# Altium project golden_arduino.PrjPcb
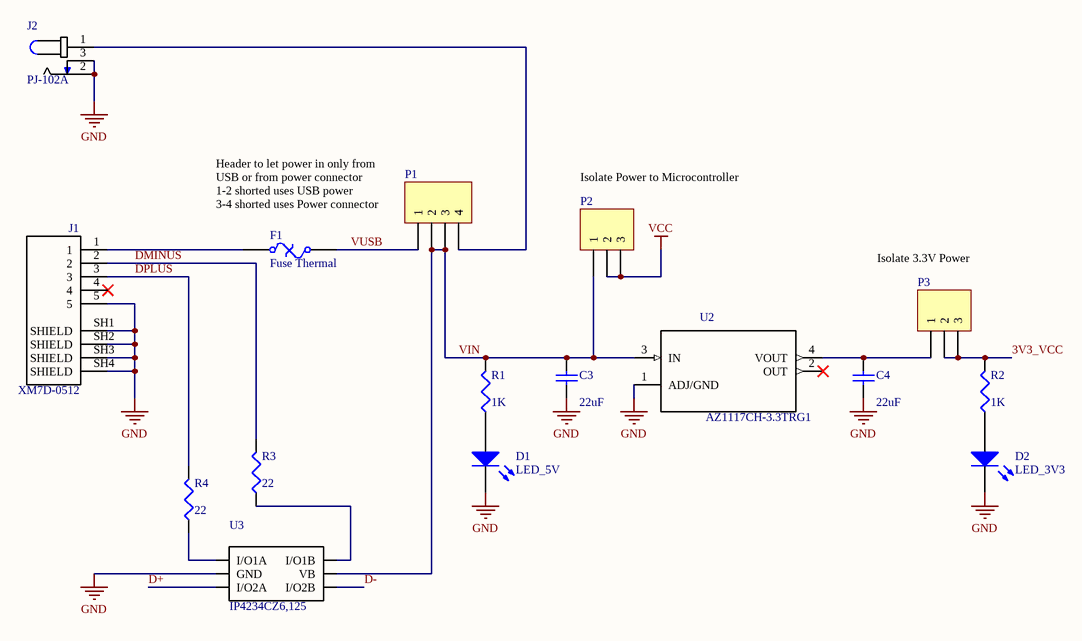
[diagram p0: power.SchDoc]
3 sheets, 59 parts. Net scope: global (net labels, ports and power ports of the same name join across sheets).
Board file: golden_arduino.PcbDoc
Sheets:
  power.SchDoc
  micro.SchDoc
  peripherals.SchDoc

## Sheet power.SchDoc: Arduino_Power
size A4; DocumentNumber: 1; SheetNumber: 1; SheetTotal: 3

### Parts
C3  value 22uF  [C1206]  (hidden comment: Cap Semi)
C4  value 22uF  [C1206]  (hidden comment: Cap Semi)
D1  LED_5V  [3.2X1.6X1.1]
D2  LED_3V3  [3.2X1.6X1.1]
F1  Fuse Thermal  [1812]
J1  XM7D-0512  [*OMRON_XM7D-0512_XM7D-0512(Primary)]
J2  PJ-102A  [*CUI_PJ-102A]
P1  Header 4  [HDR1X4]  (value not drawn)
P2  ON   OFF  [HDR1X3]  (value not drawn)
P3  3.3 NC  [HDR1X3]  (value not drawn)
R1  value 1K  [C1206]  (hidden comment: Res3)
R2  value 1K  [C1206]  (hidden comment: Res3)
R3  value 22  [C1206]  (hidden comment: Res3)
R4  value 22  [C1206]  (hidden comment: Res3)
U2  AZ1117CH-3.3TRG1  [*SOT230P696X180-4N]
U3  IP4234CZ6,125  [*SOT-457]

### Nets
GND: C3.1 C4.1 D1.2(K) D2.2(K) J1.5 J1.SH1(SHIELD) J1.SH2(SHIELD) J1.SH3(SHIELD) J1.SH4(SHIELD) J2.2 J2.3 U2.1(ADJ/GND) U3.2(GND)
VCC: P2.2 P2.3
3V3_VCC: P3.2 P3.3 R2.2
D+: U3.3(I/O2A)
D-: U3.4(I/O2B)
DMINUS: J1.2 R3.2
DPLUS: J1.3 R4.2
VIN: C3.2 P1.2 P1.3 P2.1 R1.2 U2.3(IN) U3.5(VB)
VUSB: F1.2 P1.1
NetC4_2: C4.2 P3.1 U2.4(VOUT)
NetD1_1: D1.1(A) R1.1
NetD2_1: D2.1(A) R2.1
NetF1_1: F1.1 J1.1
NetJ2_1: J2.1 P1.4
NetR3_1: R3.1 U3.6(I/O1B)
NetR4_1: R4.1 U3.1(I/O1A)

Not connected (* = marked no-connect by the designer): J1 4*; U2 2(OUT)*

### Notes on the sheet
- Isolate Power to Microcontroller
- Header to let power in only from
  USB or from power connector
  1-2 shorted uses USB power
  3-4 shorted uses Power connector
- Isolate 3.3V Power
- Title
- Size:
- Date:
- A4
- Number:
- Time:
- Revision:
- Sheet
- of
- File:

### Library data of the parts
C3 C4 = Cap Semi: Capacitor (Semiconductor SIM Model); Published: 8-Jun-2000; LatestRevisionDate: 29-May-2009; LatestRevisionNote: IPC-7351 Footprint Added.; PackageReference: C1206; Publisher: Altium Limited; PackageDescription: Chip Capacitor; DigiKeyPartNo: 1276-3300-1-ND
D1 D2 = LED2: Typical RED, GREEN, YELLOW, AMBER GaAs LED; Published: 8-Jun-2000; LatestRevisionDate: 17-Jul-2002; LatestRevisionNote: Re-released for DXP Platform.; PackageVersion: Feb-2002; PackageReference: 3.2X1.6X1.1; Publisher: Altium Limited; PackageDescription: SM LED; 2 Flat Leads
F1 = Fuse Thermal: Thermal Fuse; ManufacturerPartNo: MF-MSMF050-2; Published: 24-Mar-1999; LatestRevisionDate: 17-Jul-2002; LatestRevisionNote: Re-released for DXP Platform.; PackageReference: 1812; Publisher: Altium Limited; PackageDescription: Thru-Hole; 2 Leads; DigiKeyPartNo: MF-MSMF050-2CT-ND
J1 = XM7D-0512: Conn Mini USB Type B SKT 5 POS 0.8mm Solder RA Thru-Hole 5 Terminal 1 Port; MF: Omron Electronics; Availability: Unavailable; MP: XM7D-0512; SnapEDA_Link: https://www.snapeda.com/parts/XM7D-0512/Omron%20Electronics%20Inc-EMC%20Div/view-part/?ref=snap; Price: None; Package: None; Value: *; ComponentLink1URL: https://www.digikey.com/product-detail/en/omron-electronics-inc-emc-div/XM7D-0512/OR1205-ND/4695531
J2 = PJ-102A: 2.0 mm Center Pin, 2.5 A, Right Angle, Through Hole, Tapered Pins, Dc Power Jack Connector; MF: CUI Inc.; Price: None; CUI_purchase_URL: https://www.cui.com/product/interconnect/dc-power-connectors/jacks/2.0-mm-center-pin/pj-102a?utm_source=snapeda.com&utm_medium=referral&utm_campaign=snapedaBOM; Package: None; SnapEDA_Link: https://www.snapeda.com/parts/PJ-102A/CUI%20Inc./view-part/?ref=snap; Availability: Unavailable; MP: PJ-102A; Value: *
P1 = Header 4: Header, 4-Pin; LatestRevisionDate: 17-Jul-2002; LatestRevisionNote: Re-released for DXP Platform.; Publisher: Altium Limited
P2 P3 = Header 3: Header, 3-Pin; LatestRevisionDate: 17-Jul-2002; LatestRevisionNote: Re-released for DXP Platform.; Publisher: Altium Limited
R1-R4 = Res3: Resistor; Published: 8-Jun-2000; LatestRevisionDate: 29-May-2009; LatestRevisionNote: IPC-7351 Footprint Added.; PackageReference: J1-0603; Publisher: Altium Limited; PackageDescription: Chip Resistor
U2 = LM1117MP-3.3: Voltage stabiliser; LDO, fixed; 3.3V; 0.8A; SOT223; SMD; MF: Diodes Incorporated; Price: None; Package: SOT-223 Texas Instruments; SnapEDA_Link: https://www.snapeda.com/parts/LM1117MP-3.3/NOPB/Texas%20Instruments/view-part/?ref=snap; Availability: Unavailable; MP: AZ1117CH-3.3TRG1; Value: *; DigiKeyPartNo: AZ1117CH-3.3TRG1DICT-ND
U3 = IP4234CZ6: DIODE, ESD TVS, USB2.0, SOT457; Operating Voltage: 3V; No. of Pins: 6; SVHC: No SVHC _18-Jun-2010_; MF: NXP Semiconductors; Package: SO-6 NXP Semiconductors; MP: IP4234CZ6,125; Price: None; SnapEDA_Link: https://www.snapeda.com/parts/IP4234CZ6/NXP%20Semiconductors/view-part/?ref=snap; Availability: Unavailable; Value: *

## Sheet micro.SchDoc: Arduino_Microcontroller
size A4; DocumentNumber: 2; SheetNumber: 2; SheetTotal: 3
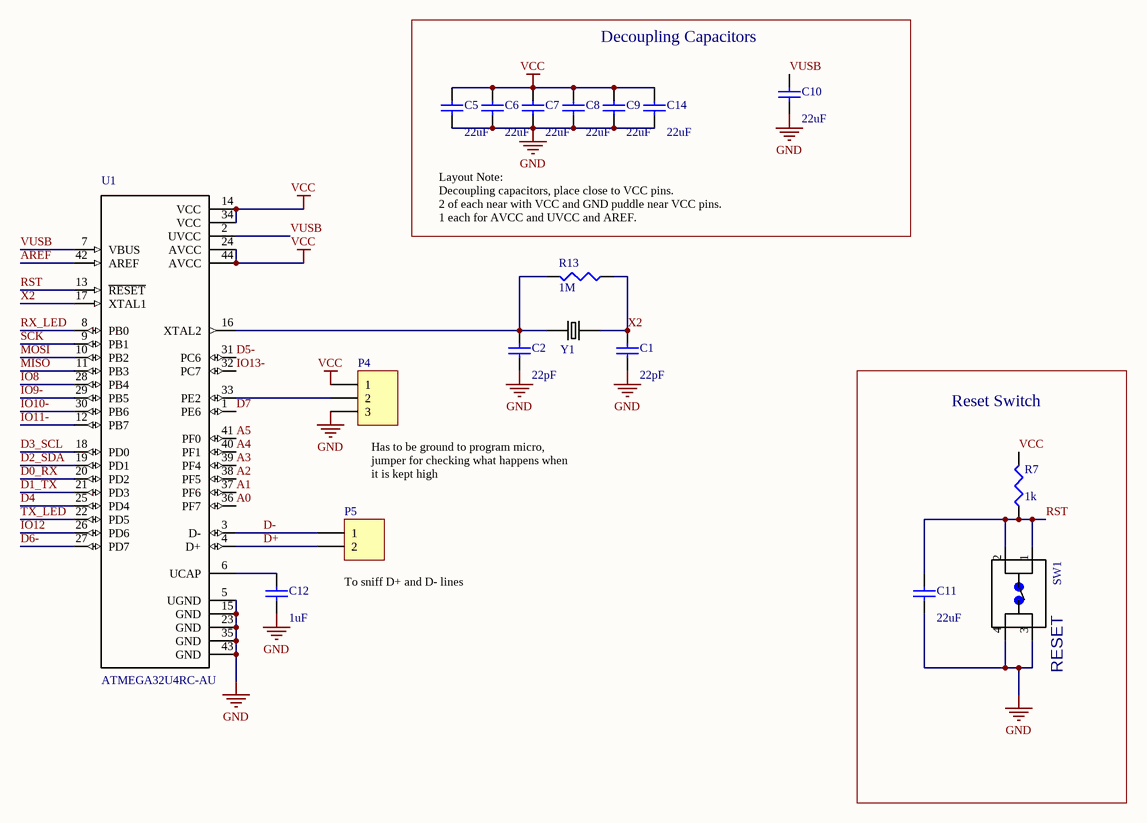
[diagram p1: micro.SchDoc]

### Parts
C1  value 22pF  [C1206]  (hidden comment: Cap Semi)
C2  value 22pF  [C1206]  (hidden comment: Cap Semi)
C5  value 22uF  [C1206]  (hidden comment: Cap Semi)
C6  value 22uF  [C1206]  (hidden comment: Cap Semi)
C7  value 22uF  [C1206]  (hidden comment: Cap Semi)
C8  value 22uF  [C1206]  (hidden comment: Cap Semi)
C9  value 22uF  [C1206]  (hidden comment: Cap Semi)
C10  value 22uF  [C1206]  (hidden comment: Cap Semi)
C11  value 22uF  [C1206]  (hidden comment: Cap Semi)
C12  value 1uF  [C1206]  (hidden comment: Cap Semi)
C14  value 22uF  [C1206]  (hidden comment: Cap Semi)
P4  +HWB-  [HDR1X3]  (value not drawn)
P5  +USB_D-  [HDR1X2]  (value not drawn)
R7  value 1k  [C1206]  (hidden comment: Res3)
R13  value 1M  [C1206]  (hidden comment: Res3)
SW1  RESET  [*TE_FSM4JSMA]
U1  ATMEGA32U4RC-AU  [*QFP80P1200X1200X120-44N]
Y1  ECS-35-17-5PX-TR  [*XTAL_ECS-35-17-5PX-TR]  (value not drawn)

### Blocks framed on the sheet
Decoupling Capacitors: C5-C10 C14
Reset Switch: C11 R7 SW1

### Nets
GND: C1.1 C2.1 C5.1 C6.1 C7.1 C8.1 C9.1 C10.1 C11.1 C12.1 C14.1 P4.3 SW1.3 SW1.4 U1.5(UGND) U1.15(GND) U1.23(GND) U1.35(GND) U1.43(GND)
VCC: C5.2 C6.2 C7.2 C8.2 C9.2 C14.2 P4.1 R7.2 U1.14(VCC) U1.24(AVCC) U1.34(VCC) U1.44(AVCC)
A0: U1.36(PF7)
A1: U1.37(PF6)
A2: U1.38(PF5)
A3: U1.39(PF4)
A4: U1.40(PF1)
A5: U1.41(PF0)
AREF: U1.42(AREF)
D0_RX: U1.20(PD2)
D1_TX: U1.21(PD3)
D2_SDA: U1.19(PD1)
D3_SCL: U1.18(PD0)
D4: U1.25(PD4)
D5-: U1.31(PC6)
D6-: U1.27(PD7)
D7: U1.1(PE6)
D+: P5.2 U1.4(D+)
D-: P5.1 U1.3(D-)
IO8: U1.28(PB4)
IO9-: U1.29(PB5)
IO10-: U1.30(PB6)
IO11-: U1.12(PB7)
IO12: U1.26(PD6)
IO13-: U1.32(PC7)
MISO: U1.11(PB3)
MOSI: U1.10(PB2)
RST: C11.2 R7.1 SW1.1 SW1.2 U1.13(~{RESET})
RX_LED: U1.8(PB0)
SCK: U1.9(PB1)
TX_LED: U1.22(PD5)
VUSB: C10.2 U1.2(UVCC) U1.7(VBUS)
X2: C1.2 R13.1 U1.17(XTAL1) Y1.2
NetC2_2: C2.2 R13.2 U1.16(XTAL2) Y1.1
NetC12_2: C12.2 U1.6(UCAP)
NetP4_2: P4.2 U1.33(PE2)

### Notes on the sheet
- Layout Note:
  Decoupling capacitors, place close to VCC pins.
  2 of each near with VCC and GND puddle near VCC pins.
  1 each for AVCC and UVCC and AREF.
- (near P4) Has to be ground to program micro,
  jumper for checking what happens when
  it is kept high
- (near P5) To sniff D+ and D- lines
- Title
- Size:
- Date:
- A4
- Number:
- Time:
- Revision:
- Sheet
- of
- File:

### Library data of the parts
C1 C2 C5-C12 C14 = Cap Semi: Capacitor (Semiconductor SIM Model); Published: 8-Jun-2000; LatestRevisionDate: 29-May-2009; LatestRevisionNote: IPC-7351 Footprint Added.; PackageReference: C1206; Publisher: Altium Limited; PackageDescription: Chip Capacitor
  C1 C2: DigiKeyPartNo: 732-7867-1-ND
  C5-C10 C14: DigiKeyPartNo: 1276-3300-1-ND
P4 = Header 3: Header, 3-Pin; LatestRevisionDate: 17-Jul-2002; LatestRevisionNote: Re-released for DXP Platform.; Publisher: Altium Limited
P5 = Header 2: Header, 2-Pin; LatestRevisionDate: 17-Jul-2002; LatestRevisionNote: Re-released for DXP Platform.; Publisher: Altium Limited
R7 R13 = Res3: Resistor; Published: 8-Jun-2000; LatestRevisionDate: 29-May-2009; LatestRevisionNote: IPC-7351 Footprint Added.; PackageReference: 1206; Publisher: Altium Limited; PackageDescription: Chip Resistor
SW1 = FSM4JSMA: FSM4JSMA=SMT,TACTILE,PB SWITCH; MF: TE Connectivity; Package: None; EU_RoHS_Compliance: Compliant; TE_purchase_URL: https://www.te.com/usa-en/product-4-1437565-1.html?te_bu=Cor&te_type=disp&te_campaign=seda_glo_cor-seda-global-disp-prtnr-fy19-seda-model-bom-cta_sma-317_1&elqCampaignId=32493; MP: FSM4JSMA; Price: None; SnapEDA_Link: https://www.snapeda.com/parts/FSM4JSMA/TE%20Connectivity%20ALCOSWITCH%20Switches/view-part/?ref=snap; Availability: Unavailable; Value: *
U1 = ATMEGA32U4-AU: MCU 8-bit ATmega AVR RISC 32KB Flash 3.3V/5V 44-Pin TQFP; MF: Microchip; Availability: Unavailable; MP: ATMEGA32U4-AU; SnapEDA_Link: https://www.snapeda.com/parts/ATMEGA32U4-AU/Microchip/view-part/?ref=snap; Price: None; Package: TQFP-44 Microchip; Value: *; ComponentLink1URL: https://www.digikey.com/products/en?keywords=ATMEGA32U4RC-AU-ND; ComponentLink1Description: Documentation
Y1 = ECS-35-17-5PX-TR: Crystal 3.579545MHz Â±30ppm _Tol_ Â±50ppm _Stability_ 17pF FUND 150Ohm 2-Pin HC-49/USX SMD T/R; MF: ECS Inc.; Package: HC49/US ECS International; Price: None; Availability: Unavailable; MP: ECS-35-17-5PX-TR; SnapEDA_Link: https://www.snapeda.com/parts/ECS-35-17-5PX-TR/ECS%20Inc./view-part/?ref=snap; Value: *

## Sheet peripherals.SchDoc: Arduino_Peripherals
size A4; DocumentNumber: 3; SheetNumber: 3; SheetTotal: 3
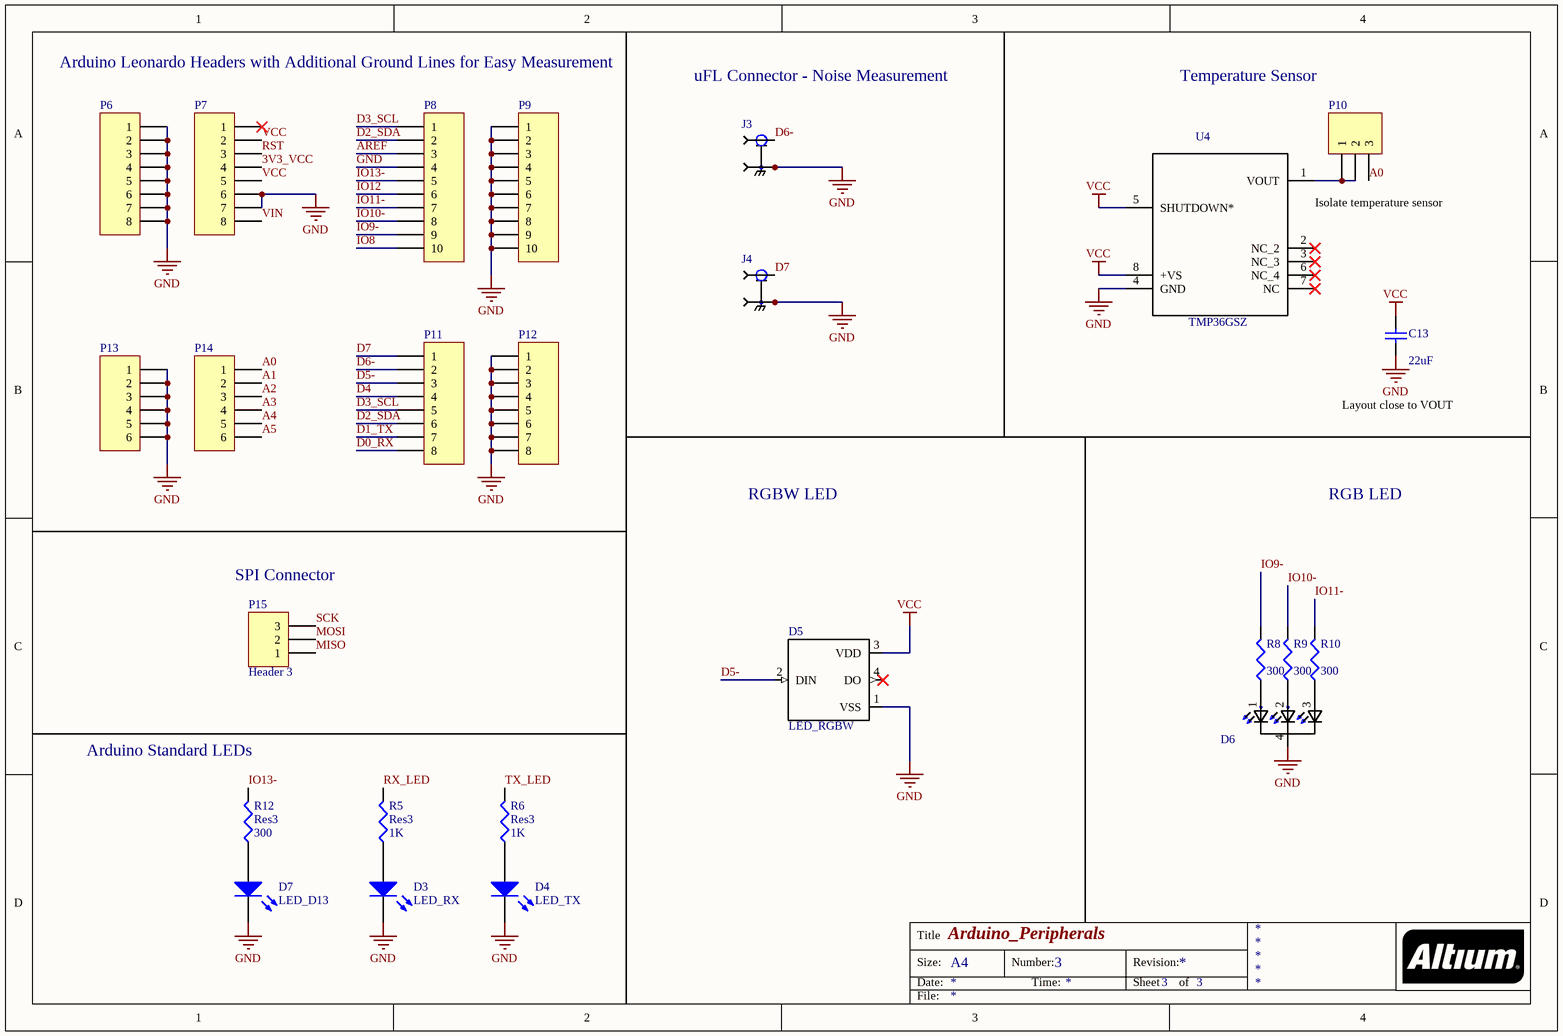
[diagram p2: peripherals.SchDoc]

### Parts
C13  value 22uF  [C1206]  (hidden comment: Cap Semi)
D3  LED_RX  [3.2X1.6X1.1]
D4  LED_TX  [3.2X1.6X1.1]
D5  LED_RGBW  [*LED_IN-PI554FCH]
D6  LED_RGB  [*LED_ASMB-KTF0-0A306]  (value not drawn)
D7  LED_D13  [3.2X1.6X1.1]
J3  U.FL-R-SMT(10)  [*TE_HRS_U.FL-R-SMT(10)]  (value not drawn)
J4  U.FL-R-SMT(10)  [*TE_HRS_U.FL-R-SMT(10)]  (value not drawn)
P6  GND  [HDR1X8]  (value not drawn)
P7  P4  [HDR1X8]  (value not drawn)
P8  P1  [HDR1X10]  (value not drawn)
P9  GND  [HDR1X10]  (value not drawn)
P10  NC A0  [HDR1X3]  (value not drawn)
P11  P2  [HDR1X8]  (value not drawn)
P12  GND  [HDR1X8]  (value not drawn)
P13  GND  [HDR1X6]  (value not drawn)
P14  P3  [HDR1X6]  (value not drawn)
P15  Header 3  [HDR1X3]
R5  Res3  value 1K  [C1206]
R6  Res3  value 1K  [C1206]
R8  value 300  [C1206]  (hidden comment: Res3)
R9  value 300  [C1206]  (hidden comment: Res3)
R10  value 300  [C1206]  (hidden comment: Res3)
R12  Res3  value 300  [C1206]
U4  TMP36GSZ  [*SOIC127P600X175-8N]

### Nets
GND: C13.1 D3.2(K) D4.2(K) D5.1(VSS) D6.4(C) D7.2(K) J3.2(GND) J3.3(GND) J4.2(GND) J4.3(GND) P6.1 P6.2 P6.3 P6.4 P6.5 P6.6 P6.7 P6.8 P7.6 P7.7 P8.4 P9.1 P9.2 P9.3 P9.4 P9.5 P9.6 P9.7 P9.8 P9.9 P9.10 P12.1 P12.2 P12.3 P12.4 P12.5 P12.6 P12.7 P12.8 P13.1 P13.2 P13.3 P13.4 P13.5 P13.6 U4.4(GND)
VCC: C13.2 D5.3(VDD) P7.2 P7.5 U4.5(SHUTDOWN*) U4.8(+VS)
3V3_VCC: P7.4
A0: P10.3 P14.1
A1: P14.2
A2: P14.3
A3: P14.4
A4: P14.5
A5: P14.6
AREF: P8.3
D0_RX: P11.8
D1_TX: P11.7
D2_SDA: P8.2 P11.6
D3_SCL: P8.1 P11.5
D4: P11.4
D5-: D5.2(DIN) P11.3
D6-: J3.1(SIG) P11.2
D7: J4.1(SIG) P11.1
IO8: P8.10
IO9-: P8.9 R8.2
IO10-: P8.8 R9.2
IO11-: P8.7 R10.2
IO12: P8.6
IO13-: P8.5 R12.2
MISO: P15.1
MOSI: P15.2
RST: P7.3
RX_LED: R5.2
SCK: P15.3
TX_LED: R6.2
VIN: P7.8
NetD3_1: D3.1(A) R5.1
NetD4_1: D4.1(A) R6.1
NetD6_1: D6.1(R) R8.1
NetD6_2: D6.2(G) R9.1
NetD6_3: D6.3(B) R10.1
NetD7_1: D7.1(A) R12.1
NetP10_1: P10.1 P10.2 U4.1(VOUT)

Not connected (* = marked no-connect by the designer): D5 4(DO)*; P7 1*; U4 2(NC_2)* 3(NC_3)* 6(NC_4)* 7(NC)*

### Notes on the sheet
- Arduino Leonardo Headers with Additional Ground Lines for Easy Measurement
- uFL Connector - Noise Measurement
- Temperature Sensor
- Isolate temperature sensor
- Layout close to VOUT
- RGBW LED
- RGB LED
- (near P15) SPI Connector
- (near R12) Arduino Standard LEDs
- Title
- Size:
- Date:
- A4
- Number:
- Time:
- Revision:
- Sheet
- of
- File:

### Library data of the parts
C13 = Cap Semi: Capacitor (Semiconductor SIM Model); Published: 8-Jun-2000; LatestRevisionDate: 29-May-2009; LatestRevisionNote: IPC-7351 Footprint Added.; PackageReference: C1206; Publisher: Altium Limited; PackageDescription: Chip Capacitor; DigiKeyPartNo: 1276-3300-1-ND
D3 D4 D7 = LED2: as D1 on sheet power; Published: 8-Jun-2000; LatestRevisionDate: 17-Jul-2002; LatestRevisionNote: Re-released for DXP Platform.; PackageVersion: Feb-2002; PackageReference: 3.2X1.6X1.1; Publisher: Altium Limited; PackageDescription: SM LED; 2 Flat Leads
D5 = IN-PI554FCH: 5050RGB with integrated IC built in 4 PIN Â•Viewing angle: 120 degrees; MF: Inolux; Availability: Unavailable; Price: None; MP: IN-PI554FCH; Package: SMD-4 Innolux; SnapEDA_Link: https://www.snapeda.com/parts/IN-PI554FCH/Inolux/view-part/?ref=snap; Value: *; DigiKeyPartNo: 1830-1209-1-ND
D6 = ASMB-KTF0-0A306: 2220 Tricolor PLCC4 Surface Mount LED; MP: XZM2CRKM2DGFBB45SCCB; MF: SunLED; Availability: Unavailable; Price: None; Package: PLCC-4 Broadcom; SnapEDA_Link: https://www.snapeda.com/parts/ASMB-KTF0-0A306/Broadcom%20Limited/view-part/?ref=snap; Value: *; DigiKeyPartNo: 1497-1225-1-ND
J3 J4 = U.FL-R-SMT(10): U.FL Series 50 Ohm Receptacle Male Pins Ultra Small SMT Coaxial Connector; MF: Hirose; MP: U.FL-R-SMT_10_; Price: None; Package: FakePackage u; SnapEDA_Link: https://www.snapeda.com/parts/U.FL-R-SMT%2810%29/Hirose%20Electric%20Co%20Ltd/view-part/?ref=snap; Availability: Unavailable; Value: *
P6 P7 P11 P12 = Header 8: Header, 8-Pin; LatestRevisionDate: 17-Jul-2002; LatestRevisionNote: Re-released for DXP Platform.; Publisher: Altium Limited
P8 P9 = Header 10: Header, 10-Pin; LatestRevisionDate: 17-Jul-2002; LatestRevisionNote: Re-released for DXP Platform.; Publisher: Altium Limited
P10 P15 = Header 3: Header, 3-Pin; LatestRevisionDate: 17-Jul-2002; LatestRevisionNote: Re-released for DXP Platform.; Publisher: Altium Limited
P13 P14 = Header 6: Header, 6-Pin; LatestRevisionDate: 17-Jul-2002; LatestRevisionNote: Re-released for DXP Platform.; Publisher: Altium Limited
R5 R6 R8-R10 R12 = Res3: Resistor; Published: 8-Jun-2000; LatestRevisionDate: 29-May-2009; LatestRevisionNote: IPC-7351 Footprint Added.; PackageReference: J1-0603; Publisher: Altium Limited; PackageDescription: Chip Resistor
U4 = TMP36GSZ: Temp Sensor Analog_Voltage_ Serial _2-Wire_ 8-Pin SOIC N Tube; MF: Analog Devices; Package: SOIC-8 Analog Devices; MP: TMP36GSZ; Price: None; SnapEDA_Link: https://www.snapeda.com/parts/TMP36GSZ/Analog%20Devices%20Inc./view-part/?ref=snap; Availability: Unavailable; Value: *

## Nets that join several sheets
GND: power (13 pins), micro (19 pins), peripherals (46 pins)
VCC: power (P2.2 P2.3), micro (12 pins), peripherals (6 pins)
3V3_VCC: power (P3.2 P3.3 R2.2), peripherals (P7.4)
A0: micro (U1.36), peripherals (P10.3 P14.1)
A1: micro (U1.37), peripherals (P14.2)
A2: micro (U1.38), peripherals (P14.3)
A3: micro (U1.39), peripherals (P14.4)
A4: micro (U1.40), peripherals (P14.5)
A5: micro (U1.41), peripherals (P14.6)
AREF: micro (U1.42), peripherals (P8.3)
D0_RX: micro (U1.20), peripherals (P11.8)
D1_TX: micro (U1.21), peripherals (P11.7)
D2_SDA: micro (U1.19), peripherals (P8.2 P11.6)
D3_SCL: micro (U1.18), peripherals (P8.1 P11.5)
D4: micro (U1.25), peripherals (P11.4)
D5-: micro (U1.31), peripherals (D5.2 P11.3)
D6-: micro (U1.27), peripherals (J3.1 P11.2)
D7: micro (U1.1), peripherals (J4.1 P11.1)
D+: power (U3.3), micro (P5.2 U1.4)
D-: power (U3.4), micro (P5.1 U1.3)
IO8: micro (U1.28), peripherals (P8.10)
IO9-: micro (U1.29), peripherals (P8.9 R8.2)
IO10-: micro (U1.30), peripherals (P8.8 R9.2)
IO11-: micro (U1.12), peripherals (P8.7 R10.2)
IO12: micro (U1.26), peripherals (P8.6)
IO13-: micro (U1.32), peripherals (P8.5 R12.2)
MISO: micro (U1.11), peripherals (P15.1)
MOSI: micro (U1.10), peripherals (P15.2)
RST: micro (5 pins), peripherals (P7.3)
RX_LED: micro (U1.8), peripherals (R5.2)
SCK: micro (U1.9), peripherals (P15.3)
TX_LED: micro (U1.22), peripherals (R6.2)
VIN: power (7 pins), peripherals (P7.8)
VUSB: power (F1.2 P1.1), micro (C10.2 U1.2 U1.7)